# EAGLE design ssm (EAGLE 8.3.1)
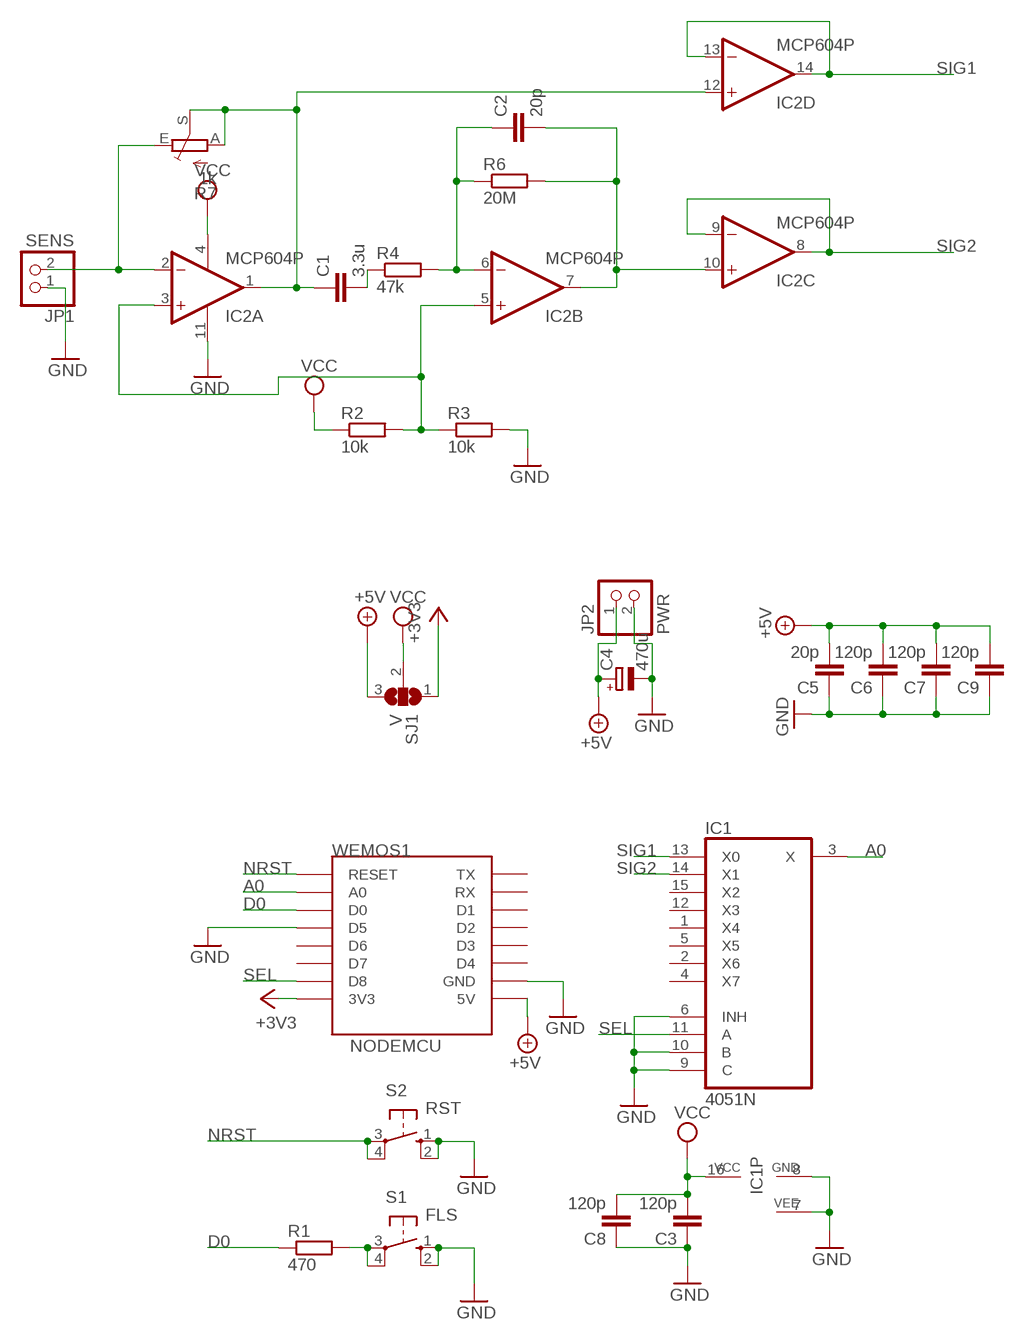
[diagram p0: schematic, sheet 1]

## Parts
C1  3.3u  C-EU  [C225-087X210]
C2  20p  C-EU025-024X044  [C025-024X044]
C3  120p  C-EU025-024X044  [C025-024X044]
C4  470u  CPOL-EUE2.5-5  [E2,5-5]
C5  20p  C-EU025-024X044  [C025-024X044]
C6  120p  C-EU025-024X044  [C025-024X044]
C7  120p  C-EU025-024X044  [C025-024X044]
C8  120p  C-EU025-024X044  [C025-024X044]
C9  120p  C-EU025-024X044  [C025-024X044]
IC1  4051N  [DIL16]
IC2  MCP604P  [DIL14]
JP1  SENS  PINHD-1X2  [1X02]
JP2  PWR  PINHD-1X2  [1X02]
R1  470  R-EU_0204/5  [0204/5]
R2  10k  R-EU_0204/7  [0204/7]
R3  10k  R-EU_0204/7  [0204/7]
R4  47k  R-EU_0204/7  [0204/7]
R6  20M  R-EU_0207/10  [0207/10]
R7  1k  TRIM_EU-B64Y  [B64Y]
S1  FLS  10-XX  [B3F-10XX]
S2  RST  10-XX  [B3F-10XX]
SJ1  V  SJ2W  [SJ_2]
WEMOS1  NODEMCU  WEMOS-D1-MINI  [WEMOS-D1-MINI]

## Nets
+3V3: SJ1.1 WEMOS1.3V3
+5V: C4.+ C5.2 C6.2 C7.2 C9.2 JP2.1 SJ1.3 WEMOS1.5V
A0: IC1.3(X) WEMOS1.A0
D0: R1.1 WEMOS1.D0
GND: C3.1 C4.- C5.1 C6.1 C7.1 C8.1 C9.1 IC1.6(INH) IC1.7(VEE) IC1.8(GND) IC1.9(C) IC1.10(B) IC2.11(P:V-) JP1.1 JP2.2 R3.2 S1.1(S) S1.2(S1) S2.1(S) S2.2(S1) WEMOS1.D5 WEMOS1.GND
N$2: IC2.2(A:-IN) JP1.2 R7.E
N$3: R1.2 S1.3(P) S1.4(P1)
N$4: IC2.3(A:+IN) IC2.5(B:+IN) R2.2 R3.1
N$5: C1.1 IC2.1(A:OUT) IC2.12(D:+IN) R7.A R7.S
N$6: C1.2 R4.1
N$7: C2.1 IC2.6(B:-IN) R4.2 R6.1
N$8: C2.2 IC2.7(B:OUT) IC2.10(C:+IN) R6.2
NRST: S2.3(P) S2.4(P1) WEMOS1.RESET
SEL: IC1.11(A) WEMOS1.D8
SIG1: IC1.13(X0) IC2.13(D:-IN) IC2.14(D:OUT)
SIG2: IC1.14(X1) IC2.8(C:OUT) IC2.9(C:-IN)
VCC: C3.2 C8.2 IC1.16(VCC) IC2.4(P:V+) R2.1 SJ1.2
Unconnected: IC1.1(X4) IC1.2(X6) IC1.4(X7) IC1.5(X5) IC1.12(X3) IC1.15(X2) WEMOS1.D1 WEMOS1.D2 WEMOS1.D3 WEMOS1.D4 WEMOS1.D6 WEMOS1.D7 WEMOS1.RX WEMOS1.TX

## Library data of the parts
C1 = Cap:C-EU: CAPACITOR, European symbol
C2 C3 C5-C9 = rcl:C-EU: CAPACITOR, European symbol
C4 = rcl:CPOL-EU: POLARIZED CAPACITOR, European symbol
IC1 = 40xx:4051: 8-channel ANALOG MULTIPLEXER
IC2 = linear:MCP604: Quad Op Amp 2.7V to 6.0V Single Supply CMOS Source: http://ww1.microchip.com/downloads/en/DeviceDoc/21314g.pdf
JP1 JP2 = pinhead:PINHD-1X2: PIN HEADER
R1 R6 = rcl:R-EU_: RESISTOR, European symbol
R2-R4 = resistor:R-EU_: RESISTOR, European symbol
R7 = pot:TRIM_EU-: POTENTIOMETER
S1 S2 = switch-omron:10-XX: OMRON SWITCH; MPN: B3F-1000; OC_FARNELL: 176432; OC_NEWARK: 36M3542
SJ1 = jumper:SJ2W: SMD solder JUMPER
WEMOS1 = esp8266modules:WEMOS-D1-MINI: WeMos.cc D1 mini ESP8266 module

## Net classes
0 default: clearance 0.205 mm

## Board
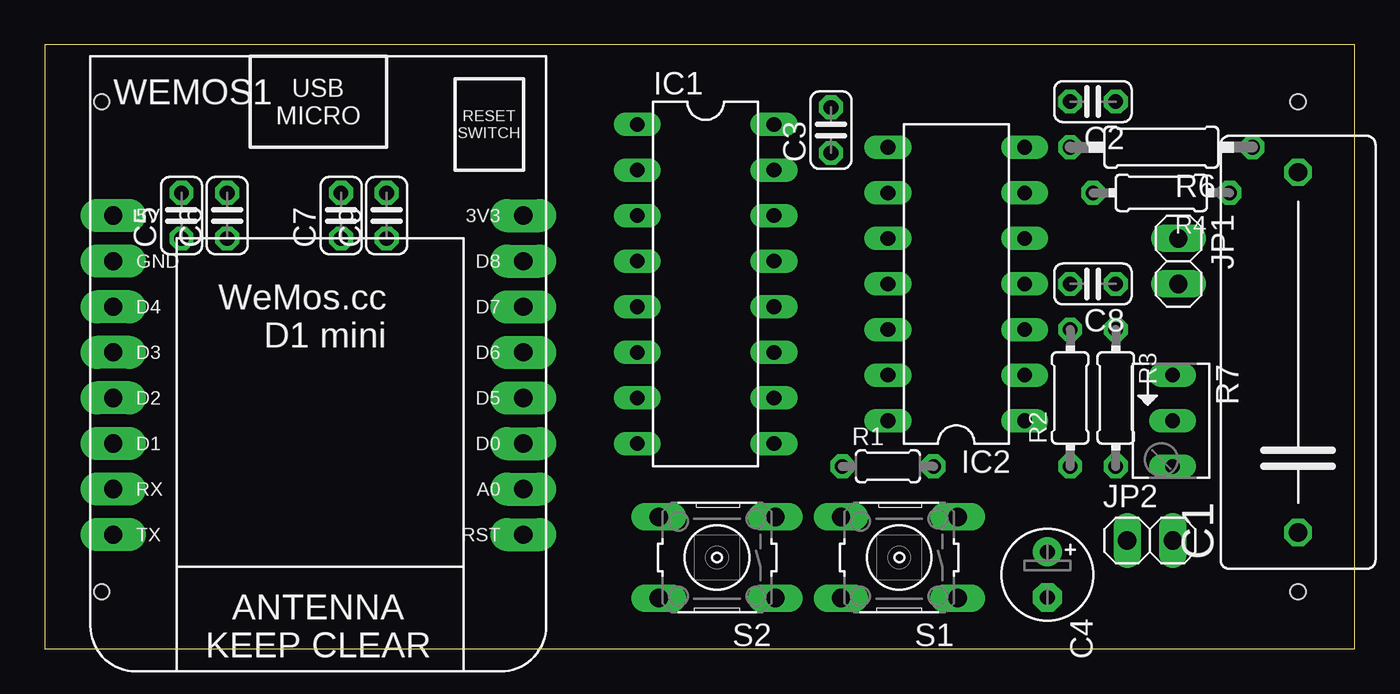
[diagram p1: board, top side]
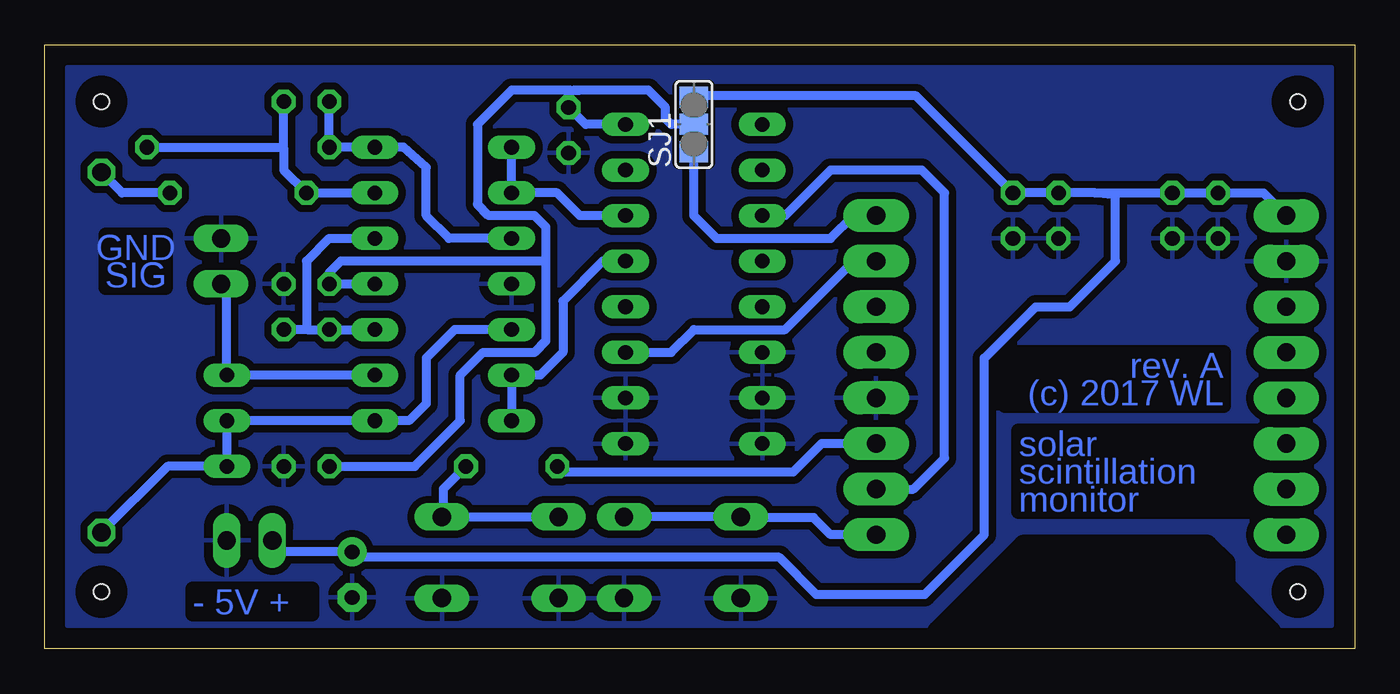
[diagram p2: board, bottom side, seen from below]

Size 73 x 33.64 mm. Coordinates in mm from the lower left corner, seen from the top.
Outline: 0,0 73,0 73,33.64 0,33.64 0,0
Copper layers (1*16): Top 0.035mm / dielectric 1.5mm / Bottom 0.035mm
Design rules "default *": minimum track width 6mil, minimum drill 0.35mm, track to track 6mil, track to pad 6mil, pad to pad 6mil, via to via 6mil, smd to smd 6mil, copper to edge 40mil, drill to drill 6mil, minimum pad ring 10mil, minimum via ring 8mil, stop-mask expansion 4mil, vias tented up to drill 0mil, thermal gap 20mil
Holes 0.85 mm at 3.18,30.48 3.18,3.18 69.85,3.18 69.85,30.48
bRestrict: area 4.8,1 to 23.2,5.7; area 47.6,26.4 to 47.9,26.7

### Footprints (pad centres in the part's own frame; a part is rotated, then mirrored left to right if it is on the bottom)
C225-087X210 = drill 1.016 octagon: 1 -11.303,0; 2 8.763,0
C025-024X044 = drill 0.813 octagon: 1 -1.27,0; 2 1.27,0
E2,5-5 = drill 0.813 pad 1.6: + -1.27,0 | drill 0.813 pad 1.6 octagon: - 1.27,0
DIL16 = drill 0.813 long: 1 -8.89,-3.81; 2 -6.35,-3.81; 3 -3.81,-3.81; 4 -1.27,-3.81; 5 1.27,-3.81; 6 3.81,-3.81; 7 6.35,-3.81; 8 8.89,-3.81; 9 8.89,3.81; 10 6.35,3.81; 11 3.81,3.81; 12 1.27,3.81; 13 -1.27,3.81; 14 -3.81,3.81; 15 -6.35,3.81; 16 -8.89,3.81
DIL14 = drill 0.813 long: 1 -7.62,-3.81; 2 -5.08,-3.81; 3 -2.54,-3.81; 4 0,-3.81; 5 2.54,-3.81; 6 5.08,-3.81; 7 7.62,-3.81; 8 7.62,3.81; 9 5.08,3.81; 10 2.54,3.81; 11 0,3.81; 12 -2.54,3.81; 13 -5.08,3.81; 14 -7.62,3.81
1X02 = drill 1.016 long: 1 -1.27,0; 2 1.27,0
0204/5 = drill 0.813 octagon: 1 -2.54,0; 2 2.54,0
0204/7 = drill 0.813 octagon: 1 -3.81,0; 2 3.81,0
0207/10 = drill 0.813 octagon: 1 -5.08,0; 2 5.08,0
B64Y = drill 0.813 long: A 2.54,0; E -2.54,0; S 0,0
B3F-10XX = drill 1.016 long: 1 -3.251,2.261; 2 3.251,2.261; 3 -3.251,-2.261; 4 3.251,-2.261
SJ_2 = smd 1.168 x 1.6: 1 -1.524,0; 2 0,0; 3 1.524,0
WEMOS-D1-MINI = drill 1.016 pad 1.829 long: 3V3 -10.16,-10.16; 5V 12.7,-10.16; A0 -10.16,5.08; D0 -10.16,2.54; D1 12.7,2.54; D2 12.7,0; D3 12.7,-2.54; D4 12.7,-5.08; D5 -10.16,0; D6 -10.16,-2.54; D7 -10.16,-5.08; D8 -10.16,-7.62; GND 12.7,-7.62; RESET -10.16,7.62; RX 12.7,5.08; TX 12.7,7.62

### Placement (x,y rotation side)
C1  69.85,17.78 90 top
C2  58.42,30.48 180 top
C3  43.81,28.89 90 top
C4  55.88,4.13 270 top
C5  7.62,24.13 90 top
C6  10.16,24.13 90 top
C7  16.51,24.13 90 top
C8  58.42,20.32 180 top
C9  19.05,24.13 90 top
IC1  36.83,20.32 270 top
IC2  50.8,20.32 90 top
JP1  63.18,21.59 270 top
JP2  61.59,6.03 0 top
R1  46.99,10.16 0 top
R2  57.15,13.97 90 top
R3  59.69,13.97 270 top
R4  62.23,25.4 180 top
R6  62.23,27.94 180 top
R7  62.86,12.7 270 top
S1  47.62,5.08 180 top
S2  37.46,5.08 180 top
SJ1  36.83,29.21 90 bottom
WEMOS1  16.51,13.97 180 top

### Tracks (layer width: path | path; a pad name or v marks a point on that pad's centre or on a via)
+3V3
  Bottom 0.508: SJ1.1 36.83,24.13 35.56,22.86 29.21,22.86 27.94,24.13 WEMOS1.3V3
+5V
  Bottom 0.508: SJ1.3 36.77,30.8 24.45,30.8 C9.2 C7.2 14.47,25.4 | 14.47,25.4 C6.2 C5.2 5.08,25.4 WEMOS1.5V | 14.47,25.4 13.33,25.26 13.33,21.59 15.87,19.05 17.78,19.05 20.64,16.19 20.64,6.35 22.54,4.45 23.97,3.02 30.01,3.02 32.07,5.08 55.56,5.08 C4.+ 59.69,5.4 JP2.1
A0
  Bottom 0.508: IC1.3 31.75,24.13 29.21,26.67 24.13,26.67 22.86,25.4 22.86,10.62 24.59,8.89 WEMOS1.A0
D0
  Bottom 0.508: R1.1 44.13,9.84 31.3,9.84 29.71,11.43 WEMOS1.D0
GND
  pour Bottom (isolate 0.406): 1.27,32.39 1.27,1.27 71.75,1.27 71.75,32.39
N$2
  Bottom 0.508: 63.5,20.32 JP1.2 62.86,20 R7.E IC2.2
N$3
  Bottom 0.508: R1.2 50.8,8.89 50.8,8.05 S1.3 S1.4
N$4
  Bottom 0.508: IC2.5 57.15,22.86 58.42,21.59 58.42,17.82 58.38,17.78 | IC2.3 R2.2 58.38,17.78 | 58.38,17.78 R3.1
N$5
  Bottom 0.508: IC2.12 50.16,17.78 51.75,16.19 51.75,13.65 52.7,12.7 IC2.1 R7.S R7.A 66.17,10.16 C1.1
N$6
  Bottom 0.508: R4.1 68.71,25.4 C1.2
N$7
  Bottom 0.508: IC2.6 R4.2 59.69,26.67 59.69,27.84 | 59.69,27.84 C2.1 | R6.1 59.79,27.94 59.69,27.84
N$8
  Bottom 0.508: 55.88,27.94 IC2.7 | 48.26,22.86 IC2.10 50.48,22.86 51.75,24.13 51.75,26.81 53.02,27.94 IC2.7 | IC2.7 R6.2 C2.2
NRST
  Bottom 0.508: S2.3 S2.4 34.18,7.3 30.16,7.3 29.21,6.35 WEMOS1.RESET
SEL
  Bottom 0.508: IC1.11 38.1,16.51 36.83,17.78 31.75,17.78 27.94,21.59 WEMOS1.D8
SIG1
  Bottom 0.508: IC2.14 IC2.13 45.4,15.24 44.13,16.51 44.13,19.37 41.91,21.59 IC1.13
SIG2
  Bottom 0.508: IC1.14 43.18,24.13 44.45,25.4 IC2.9 IC2.8
VCC
  Bottom 0.508: 45.08,21.59 45.08,23.5 45.72,24.13 48.26,24.13 48.89,24.76 48.89,29.21 46.99,31.11 43.76,31.11 | 45.08,21.59 45.08,17.14 45.72,16.51 48.58,16.51 49.85,15.24 49.85,12.7 52.39,10.16 R2.1 | 57.07,20.32 IC2.4 | 57.07,20.32 C8.2 | SJ1.2 38.1,29.21 38.42,29.53 38.42,30.16 39.37,31.11 43.18,31.11 | 43.18,31.11 43.5,31.11 | 57.07,20.32 57.15,20.4 57.15,20.96 56.52,21.59 45.08,21.59 | 43.76,31.11 43.18,31.11 | 43.76,31.11 43.81,31.06 C3.2 42.86,29.21 IC1.16

### Text on the board
Bottom: GND / SIG | rev. A / (c) 2017 WL | solar / scintillation / monitor | - 5V +
tValues: GND / SIG | + 5V -